# Altium schematic sheet USB.SchDoc
size 393 x 281 mm; PageSetup: Record=PageOptions|CenterHorizontal=True|CenterVertical=True|PrintScale=0.94|XCorrection=0.00|YCorrection=0.00|PrintKind=0|BorderSize=5000000|LeftOffset=0|BottomOffset=0|Orientation=2|PaperLength=1000|PaperWidth=1000|Scale=100|PaperSource=15|PrintQuality=600|MediaType=1|DitherType=10|PrintScaleMode=1|PaperKind=A4; Adr1: August Barks gata 6B; Adr2: SE-421 32 Västra Frölunda; Adr3: Sweden; Webpage: www.omnisys.se
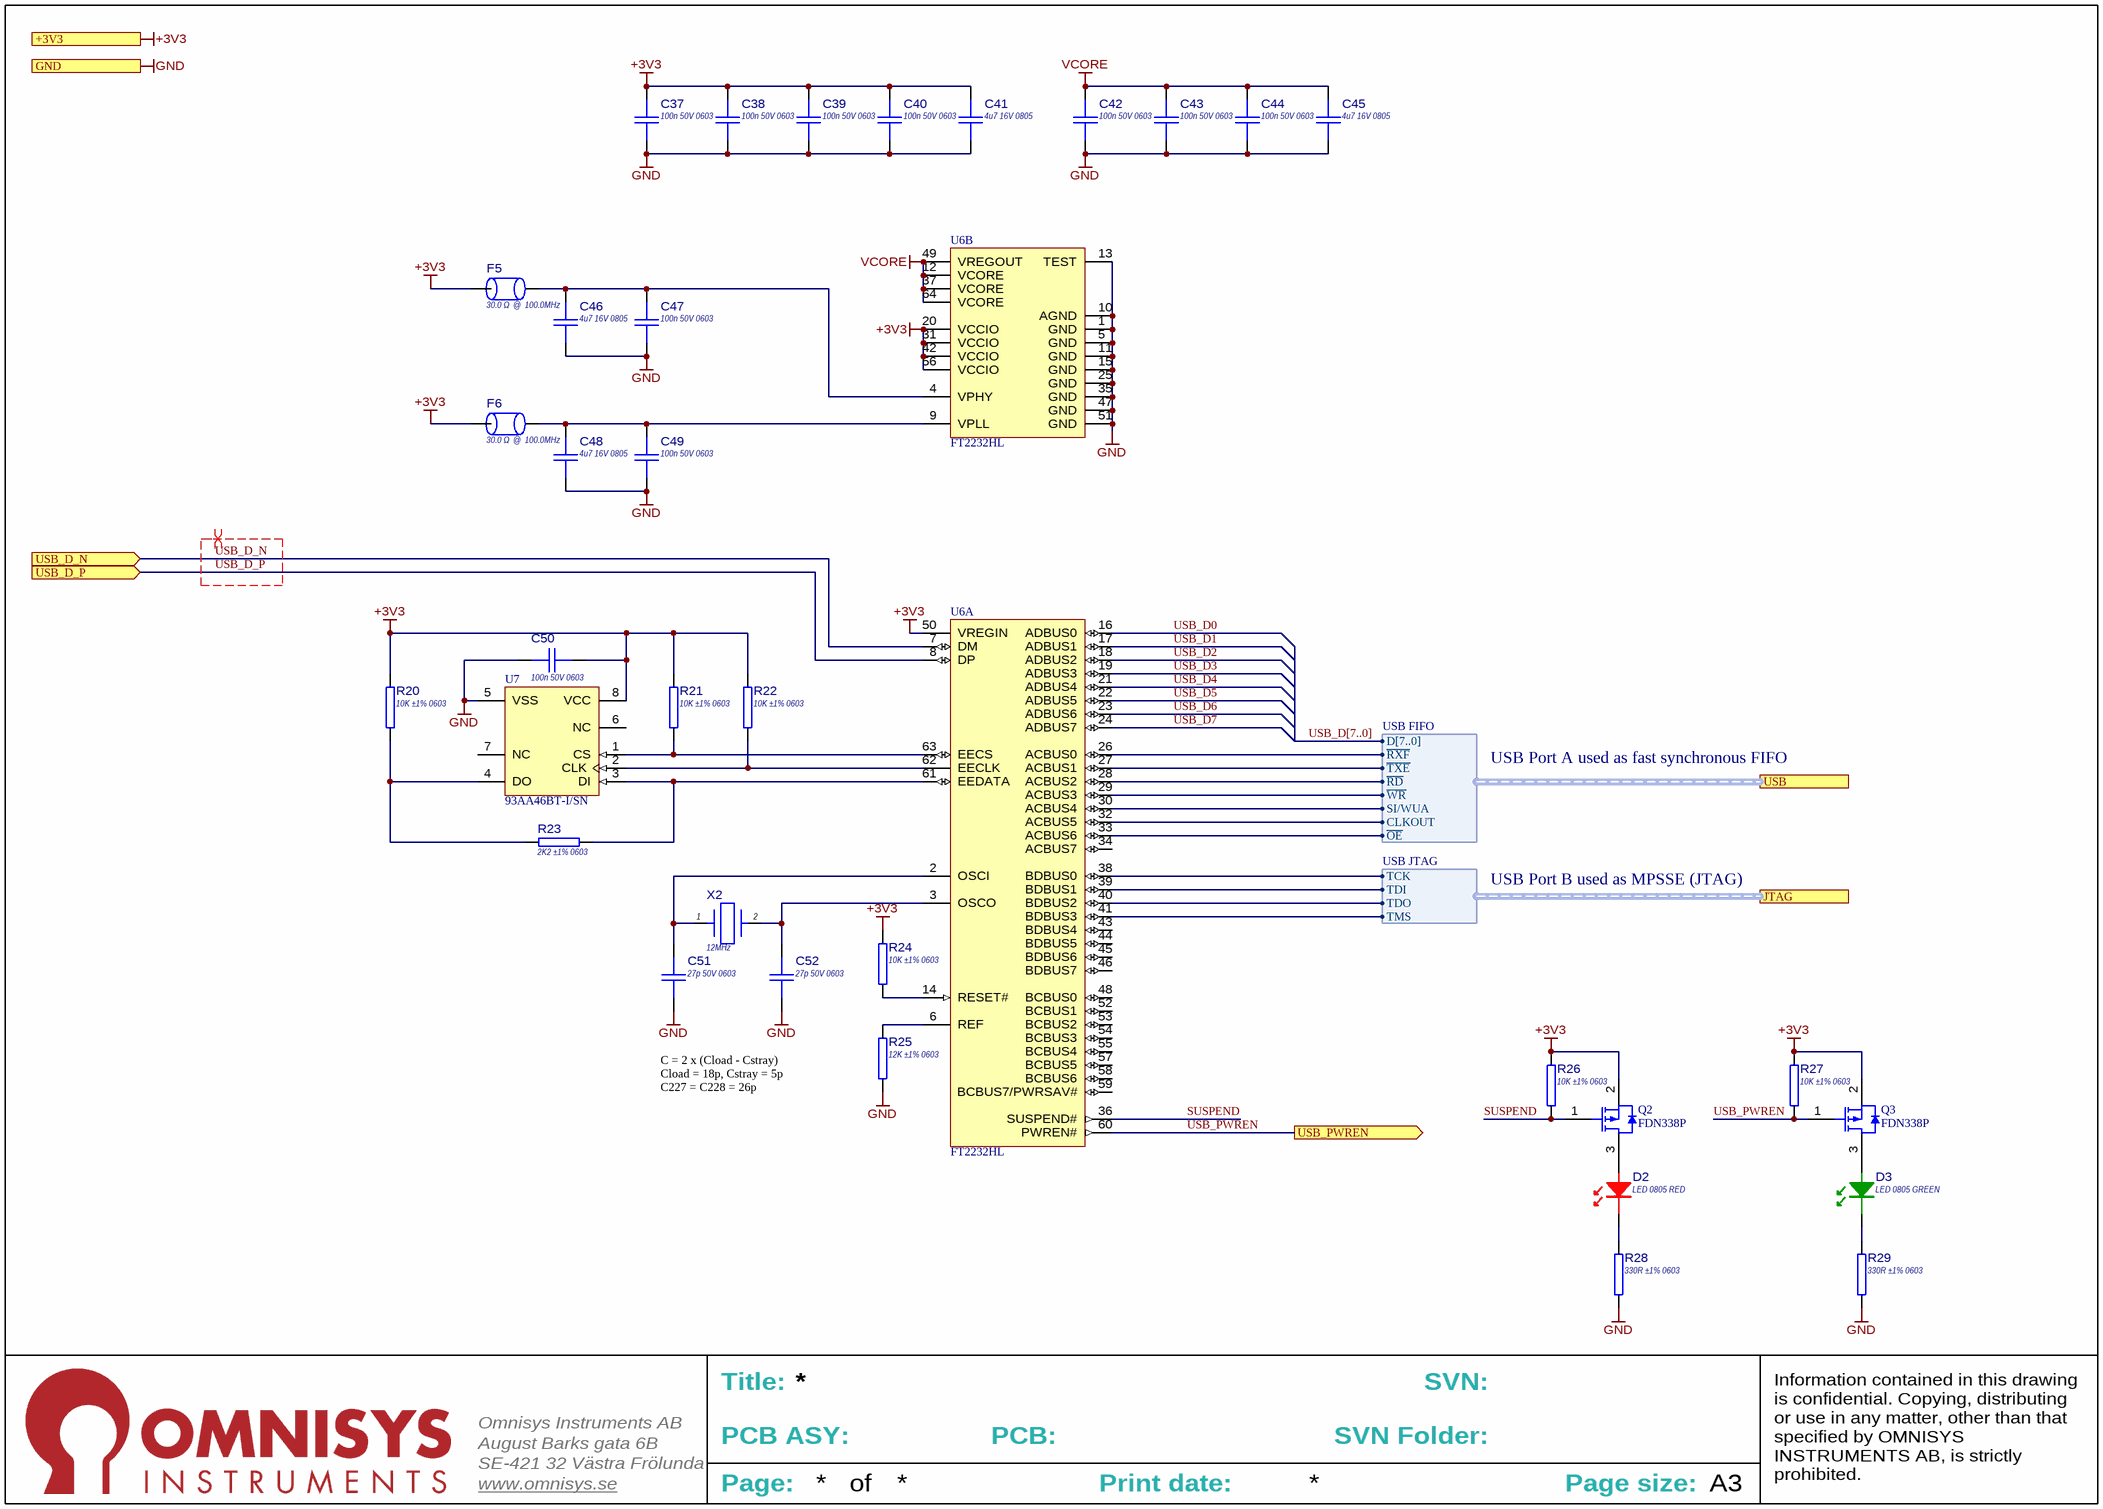
[diagram p0: USB.SchDoc]

## Parts
C37  100n 50V 0603  [CAPC1608X90N]
C38  100n 50V 0603  [CAPC1608X90N]
C39  100n 50V 0603  [CAPC1608X90N]
C40  100n 50V 0603  [CAPC1608X90N]
C41  4u7 16V 0805  [CAPC2012X140N]
C42  100n 50V 0603  [CAPC1608X90N]
C43  100n 50V 0603  [CAPC1608X90N]
C44  100n 50V 0603  [CAPC1608X90N]
C45  4u7 16V 0805  [CAPC2012X140N]
C46  4u7 16V 0805  [CAPC2012X140N]
C47  100n 50V 0603  [CAPC1608X90N]
C48  4u7 16V 0805  [CAPC2012X140N]
C49  100n 50V 0603  [CAPC1608X90N]
C50  100n 50V 0603  [CAPC1608X90N]
C51  27p 50V 0603  [CAPC1608X90N]
C52  27p 50V 0603  [CAPC1608X90N]
D2  LED 0805 RED  [LED2012-RED]
D3  LED 0805 GREEN  [LED2012-GREEN]
F5  30.0 Ω  @  100.0MHz  [INDC2012X11N]
F6  30.0 Ω  @  100.0MHz  [INDC2012X11N]
Q2  FDN338P  [FAIR-SSOT3L-3_V]
Q3  FDN338P  [FAIR-SSOT3L-3_V]
R20  10K ±1% 0603  [RESC1608N]
R21  10K ±1% 0603  [RESC1608N]
R22  10K ±1% 0603  [RESC1608N]
R23  2K2 ±1% 0603  [RESC1608N]
R24  10K ±1% 0603  [RESC1608N]
R25  12K ±1% 0603  [RESC1608N]
R26  10K ±1% 0603  [RESC1608N]
R27  10K ±1% 0603  [RESC1608N]
R28  330R ±1% 0603  [RESC1608N]
R29  330R ±1% 0603  [RESC1608N]
U6  FT2232HL  [FTDI-LQFP-64_L]  (parts A,B of 2)
U7  93AA46BT-I/SN  [SOIC-SN8_L]
X2  12MHz  [XTAL_5x3.2MM]

## Ports
+3V3, GND, JTAG (harness USB JTAG), USB (harness USB FIFO), USB_D_N (in), USB_D_P (in), USB_PWREN (out)

## Harnesses
USB JTAG: TCK, TDI, TDO, TMS
USB FIFO: D[7..0], ~{RXF}, ~{TXE}, ~{RD}, ~{WR}, SI/WUA, CLKOUT, ~{OE}

## Nets
+3V3: C37.1 C38.1 C39.1 C40.1 C41.2 C50.2 F5.1 F6.1 Q2.2(SOURCE) Q3.2(SOURCE) R20.2 R21.2 R22.2 R24.1 R26.2 R27.2 U6.20(VCCIO) U6.31(VCCIO) U6.42(VCCIO) U6.50(VREGIN) U6.56(VCCIO) U7.8(VCC) ; port +3V3
GND: C37.2 C38.2 C39.2 C40.2 C41.1 C42.2 C43.2 C44.2 C45.1 C46.1 C47.1 C48.1 C49.1 C50.1 C51.1 C52.1 R25.1 R28.1 R29.1 U6.1(GND) U6.5(GND) U6.10(AGND) U6.11(GND) U6.13(TEST) U6.15(GND) U6.25(GND) U6.35(GND) U6.47(GND) U6.51(GND) U7.5(VSS) ; port GND
VCORE: C42.1 C43.1 C44.1 C45.2 U6.12(VCORE) U6.37(VCORE) U6.49(VREGOUT) U6.64(VCORE)
SUSPEND: Q2.1(GATE) R26.1 U6.36(SUSPEND#)
USB_D0: U6.16(ADBUS0)
USB_D1: U6.17(ADBUS1)
USB_D2: U6.18(ADBUS2)
USB_D3: U6.19(ADBUS3)
USB_D4: U6.21(ADBUS4)
USB_D5: U6.22(ADBUS5)
USB_D6: U6.23(ADBUS6)
USB_D7: U6.24(ADBUS7)
USB_D_N: U6.7(DM) ; port USB_D_N
USB_D_P: U6.8(DP) ; port USB_D_P
USB_PWREN: Q3.1(GATE) R27.1 U6.60(PWREN#) ; port USB_PWREN
NetC46_2: C46.2 C47.2 F5.2 U6.4(VPHY)
NetC48_2: C48.2 C49.2 F6.2 U6.9(VPLL)
NetC51_2: C51.2 U6.2(OSCI) X2.1
NetC52_2: C52.2 U6.3(OSCO) X2.2
NetD2_1: D2.1 R28.2
NetD2_2: D2.2 Q2.3(DRAIN)
NetD3_1: D3.1 R29.2
NetD3_2: D3.2 Q3.3(DRAIN)
NetR20_1: R20.1 R23.1 U7.4(DO)
NetR21_1: R21.1 U6.63(EECS) U7.1(CS)
NetR22_1: R22.1 U6.62(EECLK) U7.2(CLK)
NetR23_2: R23.2 U6.61(EEDATA) U7.3(DI)
NetR24_2: R24.2 U6.14(RESET#)
NetR25_2: R25.2 U6.6(REF)
NetU6_26: U6.26(ACBUS0) ; port USB.~{RXF}
NetU6_27: U6.27(ACBUS1) ; port USB.~{TXE}
NetU6_28: U6.28(ACBUS2) ; port USB.~{RD}
NetU6_29: U6.29(ACBUS3) ; port USB.~{WR}
NetU6_30: U6.30(ACBUS4) ; port USB.SI/WUA
NetU6_32: U6.32(ACBUS5) ; port USB.CLKOUT
NetU6_33: U6.33(ACBUS6) ; port USB.~{OE}
NetU6_38: U6.38(BDBUS0) ; port JTAG.TCK
NetU6_39: U6.39(BDBUS1) ; port JTAG.TDI
NetU6_40: U6.40(BDBUS2) ; port JTAG.TDO
NetU6_41: U6.41(BDBUS3) ; port JTAG.TMS

Not connected (* = marked no-connect by the designer): U6 34(ACBUS7) 43(BDBUS4) 44(BDBUS5) 45(BDBUS6) 46(BDBUS7) 48(BCBUS0) 52(BCBUS1) 53(BCBUS2) 54(BCBUS3) 55(BCBUS4) 57(BCBUS5) 58(BCBUS6) 59(BCBUS7/PWRSAV#); U7 6(NC) 7(NC)

## Buses and harness runs
bus USB_D[7..0]

## Layout directives
differential pair; rule Differential Pairs Routing [Pref Gap = 0.1mm    Min Gap  = 0.1mm    Max Gap  = 0.1mmPref Width = 0.1mm    Min Width  = 0.1mm    Max Width  = 0.1mm]; net class Diffpairs_USB: USB_D_N, USB_D_P

## Notes on the sheet
- USB Port A used as fast synchronous FIFO
- USB Port B used as MPSSE (JTAG)
- C = 2 x (Cload - Cstray)
  Cload = 18p, Cstray = 5p
  C227 = C228 = 26p
- Title:
- SVN:
- August Barks gata 6B
- SE-421 32 Västra Frölunda
- Omnisys Instruments AB
- PCB ASY:
- PCB:
- SVN Folder:
- www.omnisys.se
- Page:
- of
- Print date:
- Page size:
- A3
- Information contained in this drawing is confidential. Copying, distributing or use in any matter, other than that specified by OMNISYS INSTRUMENTS AB, is strictly prohibited.

## Library data of the parts
C37-C40 C42-C44 C47 C49 C50 = CMP-0300-002665-2: 100n 50V X7R ±10% 0603 (1608 metric); PartNumber: GRM188R71H104KA93; Rated voltage (V): 50; Capacitance (F): 100.0n; Package: 1608/0603; Temperature Charateristics: X7R; Thickness (mm): 0.90; Tolerance: ±10%
C41 C45 C46 C48 = CMP-0300-003397-3: 4u7 16V X7R ±10% 0805 (2012 metric); PartNumber: GRM21BR71C475KA73; Capacitance: 4.7µF; Package: 2012/0805; Temperature Charateristics: X7R; Tolerance: 10%; Thickness: 1.4mm; Rated Voltage: 16V
C51 C52 = CMP-0300-002442-2: 27p 50V C0G ±5% 0603 (1608 metric); PartNumber: GRM1885C1H270JA01; Rated voltage (V): 50; Capacitance (F): 27.0p; Package: 1608/0603; Temperature Charateristics: C0G; Thickness (mm): 0.90; Tolerance: ±5%
D2 = CMP-1500-000001-2
D3 = CMP-1500-000004-2
F5 F6 = CMP-0600-000010-1: Ferrite bead, Würth Elektronik WE-CBF 2012 (0805), 74279206 ,  30.0 Ω  @  100.0MHz; Zmax@Freq: 55.0 Ω  @      1.0 GHz; Type: High Current; RDC: 25.0 mΩ; IDC: 3.0 A; Z@Freq: 30.0 Ω  @  100.0MHz; PartNumber: 74279206
Q2 Q3 = CMP-2000-06251-1: P-Channel Specified Power Trench(R) MOSFET, 2.5 V, -20 V, -1.6 A, -55 to 150 degC, 3-Pin SOT23, RoHS, Tape and Reel; Manufacturer: Fairchild Semiconductor; Current - Continuous Drain (Id) @ 25°C: 1.6A(Ta); Product Training Modules: HighVoltageSwitchesforPowerProcessingSMPSPowerSwitch; Gate Charge (Qg) @ Vgs: 6.2nC@4.5V; Package Version: Rev. 3, 05/2015; PCN Design/Specification: MoldCompound08/April/2008; Vgs(th) (Max) @ Id: 1.5V@250µA; FET Type: MOSFETP-Channel,MetalOxide; FET Feature: Standard; PCN Packaging: BinaryYearCodeMarking15/Jan/2014; Other Names: FDN338PTR; Online Catalog: P-ChannelLogicLevelGateFETs; Input Capacitance (Ciss) @ Vds: 451pF@10V; Rds On (Max) @ Id, Vgs: 115mOhm@1.6A,4.5V; Drain to Source Voltage (Vdss): 20V; Power - Max: 460mW; Datasheet Version: Rev. F1(W), 11/2013; Manufacturer URL: https://www.fairchildsemi.com/; Package Description: 3-Pin Small Outline Transistor, Body 2.92 x 1.4 mm, Pitch 0.95 mm; Datasheet URL: https://datasheet.ciiva.com/22655/1802191-22655335.pdf; Family: FETs-Single; Package URL: https://www.fairchildsemi.com/package-drawings/MA/MA03B.pdf; Package Reference: SSOT3L; Supplier Device Package: 3-SSOT; Standard Package: 3,000; Package / Case: TO-236-3,SC-59,SOT-23-3; Mounting Technology: SurfaceMount; Series: PowerTrench®; Mounting Type: SurfaceMount; Packaging: Tape&Reel(TR); Category: DiscreteSemiconductorProducts
R20-R22 R24 R26 R27 = CMP-1800-002045-3: 10K ±1% ±100 ppm/˚C 0.10W 75V 0603 (1608 metric); Power: 100mW; Case-EIA: 0603; Case-Metric: 1608; Temp. Coefficent: 0.01%; Value: 10k; Maximum working voltage: 75V; Tolerance: 1%; Technology: SMT
R23 = CMP-1800-002029-3: 2K2 ±1% ±100 ppm/˚C 0.10W 75V 0603 (1608 metric); Value: 2.2k; Power: 100mW; Case-EIA: 0603; Case-Metric: 1608; Temp. Coefficent: 0.01%; Maximum working voltage: 75V; Tolerance: 1%; Technology: SMT
R25 = CMP-1800-002047-3: 12K ±1% ±100 ppm/˚C 0.10W 75V 0603 (1608 metric); Power: 100mW; Case-EIA: 0603; Case-Metric: 1608; Temp. Coefficent: 0.01%; Value: 12k; Maximum working voltage: 75V; Tolerance: 1%; Technology: SMT
R28 R29 = CMP-1800-002010-3: 330R ±1% ±100 ppm/˚C 0.10W 75V 0603 (1608 metric); Value: 330; Power: 100mW; Case-EIA: 0603; Case-Metric: 1608; Temp. Coefficent: 0.01%; Maximum working voltage: 75V; Tolerance: 1%; Technology: SMT
U6 = CMP-2000-06287-1: Dual High Speed USB to Multipurpose UART / FIFO IC / , 3 to 3.6 V, -40 to 85 degC, 64- Pin LQFP, RoHS; Manufacturer: FTDI; Number of Channels per Chip: 2; Standard Supported: RS232,RS422,RS485; Maximum Data Rate: 480Mbit/s; Package Description: 64-Pin Low-profile Quad Flat Package, Body 10 x 10 mm, Pitch 0.5 mm; Maximum Operating Temperature: +85°C; Mounting Technology: SurfaceMount; Pin Count: 64; Package Reference: LQFP-64; Manufacturer URL: http://www.nxp.com/; Length: 10mm; Width: 10mm; Minimum Operating Temperature: -40°C; Dimensions: 10x10x1.4mm; Package Type: LQFP; Mounting Type: SurfaceMount; Datasheet URL: http://www.ftdichip.com/Support/Documents/DataSheets/ICs/DS_FT2232H.pdf; Datasheet Version: Rev. 2.5, 07/2016; Height: 1.4mm
U7 = CMP-0162-00270-1: 1K, 64x16-bit, 1.8V Microwire Serial EEPROM, 8-Pin SOIC 150mil, Industrial Temperature, Tape and Reel; Code_IPC: SOIC127P600-8; Code_JEDEC: MS-012; PackageVersion: revBB, Aug-2009; PackageReference: SOIC-SN8; PackageDescription: 8-Lead Plastic Small Outline (SN) - Narrow, 3.90mm Body [SOIC]; DatasheetVersion: revG, May-2008
X2 = CMP-2400-000043-3: 12MHz 5 x 3.2 mm SMD GLASS CRYSTAL, 7A-12.000MAAJ-T; PartNumber: 7A-12.000MAAJ-T